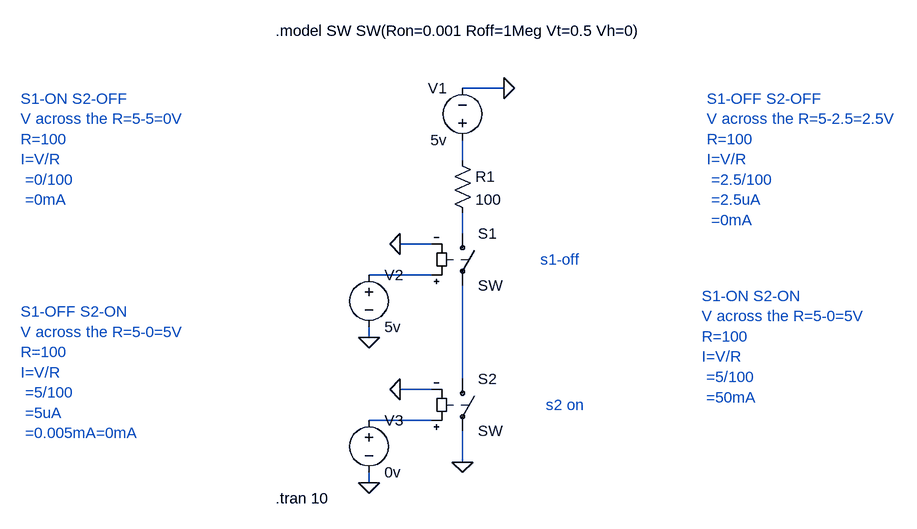
[diagram p0: schematic SW C(series+shunt).asc]
SW C(series+shunt).asc, the LTspice schematic file:
Version 4.1
SHEET 1 1276 680
WIRE 240 -352 176 -352
WIRE 176 -240 176 -272
WIRE 176 -128 176 -160
WIRE 128 -112 80 -112
WIRE 128 -64 32 -64
WIRE 32 32 32 16
WIRE 176 96 176 -48
WIRE 128 112 80 112
WIRE 128 160 32 160
WIRE 176 224 176 176
WIRE 32 256 32 240
FLAG 176 224 0
FLAG 80 112 0
FLAG 32 32 0
FLAG 32 256 0
FLAG 80 -112 0
FLAG 240 -352 0
SYMBOL voltage 176 -256 R180
WINDOW 0 24 96 Left 2
WINDOW 3 24 16 Left 2
SYMATTR InstName V1
SYMATTR Value 5v
SYMBOL res 160 -256 R0
SYMATTR InstName R1
SYMATTR Value 100
SYMBOL sw 176 -144 R0
SYMATTR InstName S1
SYMBOL sw 176 80 R0
SYMATTR InstName S2
SYMBOL voltage 32 -80 R0
SYMATTR InstName V2
SYMATTR Value 5v
SYMBOL voltage 32 144 R0
SYMATTR InstName V3
SYMATTR Value 0v
TEXT -112 -440 Left 2 !.model SW SW(Ron=0.001 Roff=1Meg Vt=0.5 Vh=0)
TEXT 296 -88 Left 2 ;s1-off
TEXT 304 136 Left 2 ;s2 on
TEXT -112 280 Left 2 !.tran 10
TEXT -504 -336 Left 2 ;S1-ON S2-OFF\nV across the R=5-5=0V\nR=100\nI=V/R\n =0/100\n =0mA
TEXT -504 -8 Left 2 ;S1-OFF S2-ON\nV across the R=5-0=5V\nR=100\nI=V/R\n =5/100\n =5uA\n =0.005mA=0mA
TEXT 552 -336 Left 2 ;S1-OFF S2-OFF\nV across the R=5-2.5=2.5V\nR=100\nI=V/R\n =2.5/100\n =2.5uA\n =0mA
TEXT 544 -32 Left 2 ;S1-ON S2-ON\nV across the R=5-0=5V\nR=100\nI=V/R\n =5/100\n =50mA

The netlist it stands for:
* SW C(series+shunt).asc
V1 N001 0 5v
R1 N001 N002 100
S1 N002 N004 N003 0 SW
S2 N004 0 N005 0 SW
V2 N003 0 5v
V3 N005 0 0v
.model SW SW(Ron=0.001 Roff=1Meg Vt=0.5 Vh=0)
* s1-off
* s2 on
.tran 10
* S1-ON S2-OFF
* V across the R=5-5=0V
* R=100
* I=V/R
*  =0/100
*  =0mA
* S1-OFF S2-ON
* V across the R=5-0=5V
* R=100
* I=V/R
*  =5/100
*  =5uA
*  =0.005mA=0mA
* S1-OFF S2-OFF
* V across the R=5-2.5=2.5V
* R=100
* I=V/R
*  =2.5/100
*  =2.5uA
*  =0mA
* S1-ON S2-ON
* V across the R=5-0=5V
* R=100
* I=V/R
*  =5/100
*  =50mA
.backanno
.end